# EAGLE design MUX-V2 (EAGLE 7.6.0)
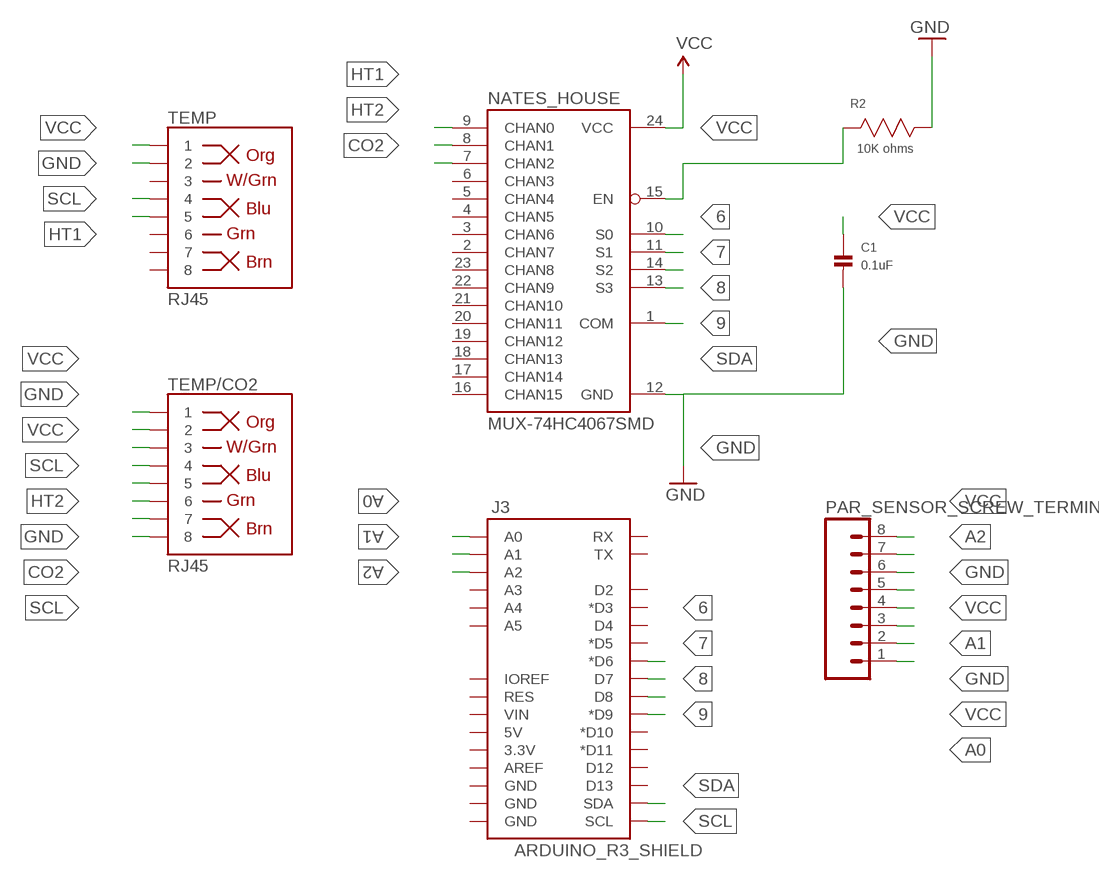
[diagram p0: schematic, sheet 1]

## Parts
C1  0.1uF  CAP_CERAMIC_0805  [_0805]
J3  ARDUINO_R3_SHIELD  [UNO_R3_SHIELD]
NATES_HOUSE  MUX-74HC4067SMD  [SSOP24]
PAR_SENSOR_SCREW_TERMINALS  M083.5MM-8  [SCREWTERMINAL-3.5MM-8]
R2  10K ohms  MCR10EZHF1002  [RESC2013X65N]
TEMP  RJ45  RJ45-8PTH  [RJ45-8]
TEMP/CO2  RJ45  RJ45-8PTH  [RJ45-8]

## Nets
6: J3.D6(*D6) NATES_HOUSE.10(S0)
7: J3.D7 NATES_HOUSE.11(S1)
8: J3.D8 NATES_HOUSE.14(S2)
9: J3.D9(*D9) NATES_HOUSE.13(S3)
12: R2.1(R1) ; supply symbol labelled GND
A0: J3.A0 PAR_SENSOR_SCREW_TERMINALS.1
A1: J3.A1 PAR_SENSOR_SCREW_TERMINALS.4
A2: J3.A2 PAR_SENSOR_SCREW_TERMINALS.7
CO2: NATES_HOUSE.7(CHAN2) TEMP/CO2.7
GND: C1.2 NATES_HOUSE.12(GND) PAR_SENSOR_SCREW_TERMINALS.3 PAR_SENSOR_SCREW_TERMINALS.6 TEMP.2 TEMP/CO2.2 TEMP/CO2.6
HT1: NATES_HOUSE.9(CHAN0) TEMP.5
HT2: NATES_HOUSE.8(CHAN1) TEMP/CO2.5
N$1: NATES_HOUSE.15(EN) R2.2(R2)
SCL: J3.SCL TEMP.4 TEMP/CO2.4 TEMP/CO2.8
SDA: J3.SDA NATES_HOUSE.1(COM)
VCC: C1.1 NATES_HOUSE.24(VCC) PAR_SENSOR_SCREW_TERMINALS.2 PAR_SENSOR_SCREW_TERMINALS.5 PAR_SENSOR_SCREW_TERMINALS.8 TEMP.1 TEMP/CO2.1 TEMP/CO2.3
Unconnected: J3.3.3V J3.5V J3.A3 J3.A4 J3.A5 J3.AREF J3.D2 J3.D3(*D3) J3.D4 J3.D5(*D5) J3.D10(*D10) J3.D11(*D11) J3.D12 J3.D13 J3.GND@0(GND) J3.GND@1(GND) J3.GND@2(GND) J3.IOREF J3.RES J3.RX J3.TX J3.VIN NATES_HOUSE.2(CHAN7) NATES_HOUSE.3(CHAN6) NATES_HOUSE.4(CHAN5) NATES_HOUSE.5(CHAN4) NATES_HOUSE.6(CHAN3) NATES_HOUSE.16(CHAN15) NATES_HOUSE.17(CHAN14) NATES_HOUSE.18(CHAN13) NATES_HOUSE.19(CHAN12) NATES_HOUSE.20(CHAN11) NATES_HOUSE.21(CHAN10) NATES_HOUSE.22(CHAN9) NATES_HOUSE.23(CHAN8) TEMP.3 TEMP.6 TEMP.7 TEMP.8

## Library data of the parts
C1 = microbuilder:CAP_CERAMIC: Ceramic Capacitors 0402 - 0402 Surface Mount Capacitors 16pF 50V 5% [Digikey: 445-4899-2-ND] 18pF 50V 5% [Digikey: 490-1281-2-ND] 22pF 50V 5% [Digikey: 490-1283-2-ND] 68pF 50V 5% [Digikey: 490-1289-2-ND] 0.1uF 10V 10% [Digikey: 490-1318-2-ND] 1.0uF 6.3V 10% [Digikey: 490-1320-2-ND] 0603 - 0603 Surface Mount Capacitors 16 pF 50V 5% [Digikey: 445-5051-2-ND] 22 pF 50V [Digikey: PCC220ACVTR-ND] 33 pF 50V 5% [Digikey: 490-1415-1-ND] 56pF 50V 5% [Digikey: 490-1421-1-ND] 220pF 50V 5% [Digikey: 445-1285-1-ND] 680 pF 50V 2200 pF 50V 5% C0G [Digikey: 445-1297-1-ND] 5600 pF 100V 5% X7R [Digikey: 478-3711-1-ND] 0.1 µF 25V 10% [Digikey: PCC2277TR-ND] 0.22 µF 16V 10% X7R [Digikey: 445-1318-1-ND] 1.0 µF 25V 10% [Digikey: 445-5146-2-ND] 0603 - RF Specific 3pF 250V +/-0.1pF RF [Digikey: 712-1347-1-ND] 18 pF 250V 5% [Digikey: 478-3505-1-ND or 712-1322-1-ND] 56 pF 250V 5% C0G RF [Digikey: 490-4867-1-ND] 68 pF 250V RF [Digikey: 490-4868-1-ND] 0805 - 0805 Surface Mount Capacitors 220 pF 250V 2% RF Ceramic Capacitor [Digikey: 712-1398-1-ND] 1000 pF 50V 2% NP0 Ceramic Capacitor [Digikey: 478-3760-1-ND] 0.1 µF 25V 10% Ceramic Capacitor [Digikey: PCC1828TR-ND] 1.0 µF 16V 10% Ceramic Capacitor[Digikey: 490-1691-2-ND] 10.0 µF 10V 10% Ceramic Capacitor[Digikey: 709-1228-1-ND] 10.0 uF 16V 10% Ceramic Capacitor [Digikey: 478-5165-2-ND] 47 uF 6.3V 20% Ceramic Capacitor [Digikey: 587-1779-1-ND or 399-5506-1-ND] 1206 - 1206 Surface Mount Capacitors 47uF 10V 20% Ceramic Capacitor [Digikey: 490-5528-1-ND or 399-5508-1-ND or 445-6010-1-ND] 100uF 6.3V -20%, +80% Y5V Ceramic Capacitor (Digikey: 490-4512-1-ND, Mouser: 81-GRM31CF50J107ZE1L)
J3 = SparkFun-Boards:ARDUINO_R3_SHIELD: Shield form compatible with the Arduino Uno R3.
NATES_HOUSE = SparkFun-AnalogIC:MUX-74HC4067: 16-channel analog MUX; PROD_ID: IC-08252
PAR_SENSOR_SCREW_TERMINALS = SparkFun-Connectors:M08: Header 8 Standard 8-pin 0.1" header. Use with straight break away headers (SKU : PRT-00116), right angle break away headers (PRT-00553), swiss pins (PRT-00743), machine pins (PRT-00117), and female headers (PRT-00115).
R2 = ROHM_By_element14_Batch_1:MCR10EZHF1002: RESISTOR, 0805; MPN: MCR10EZHF1002; OC_FARNELL: -; OC_NEWARK: 08P3530; SUPPLIER: ROHM; TOLERANCE: ±1%; VALUE: 10K Ohms; WATTAGE: 1/8 W
TEMP TEMP/CO2 = SparkFun-Connectors:RJ45-8: RJ45 Jack Simple RJ45, 8-pin connection - connector for common Cat5, Cat5e, and Cat6 Ethernet cables. Footprint not yet proven in production. Connector sku is PRT-00643; Breakout PCB sku is BOB-00716.; PROD_ID: CONN-08506

## Net classes
0 default: width 0.305 mm, drill 0.508 mm, clearance 0.254 mm

## Board
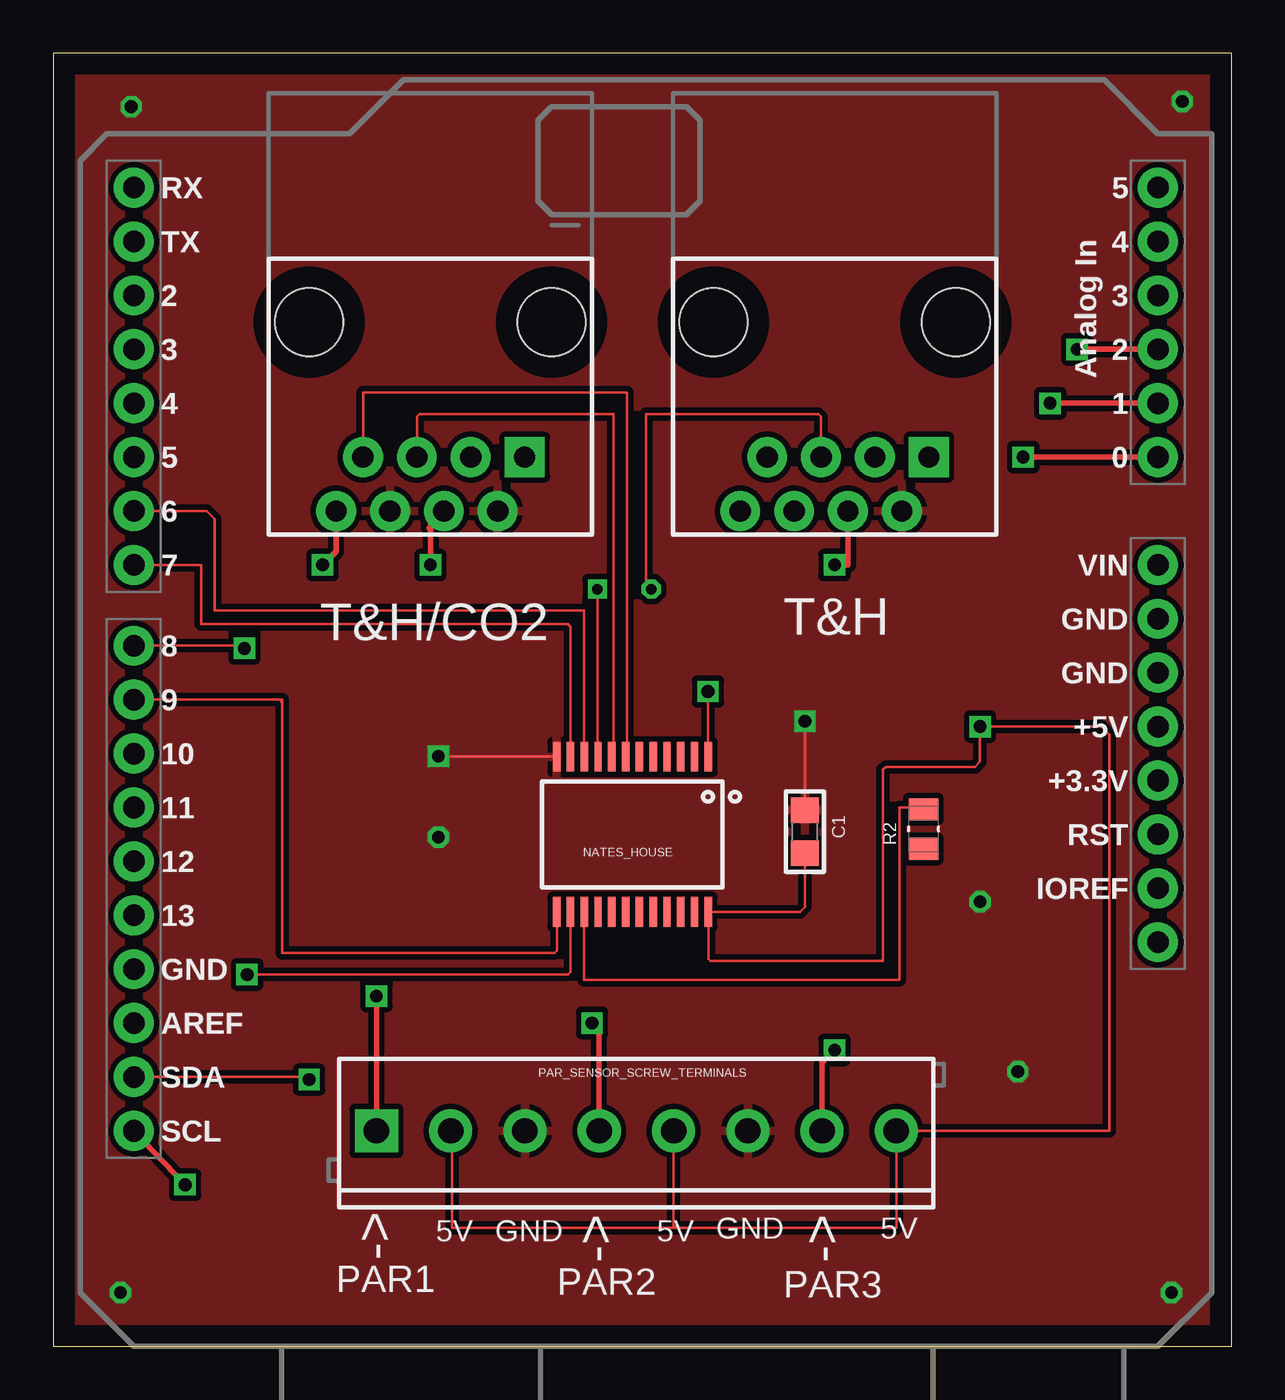
[diagram p1: board, top side]
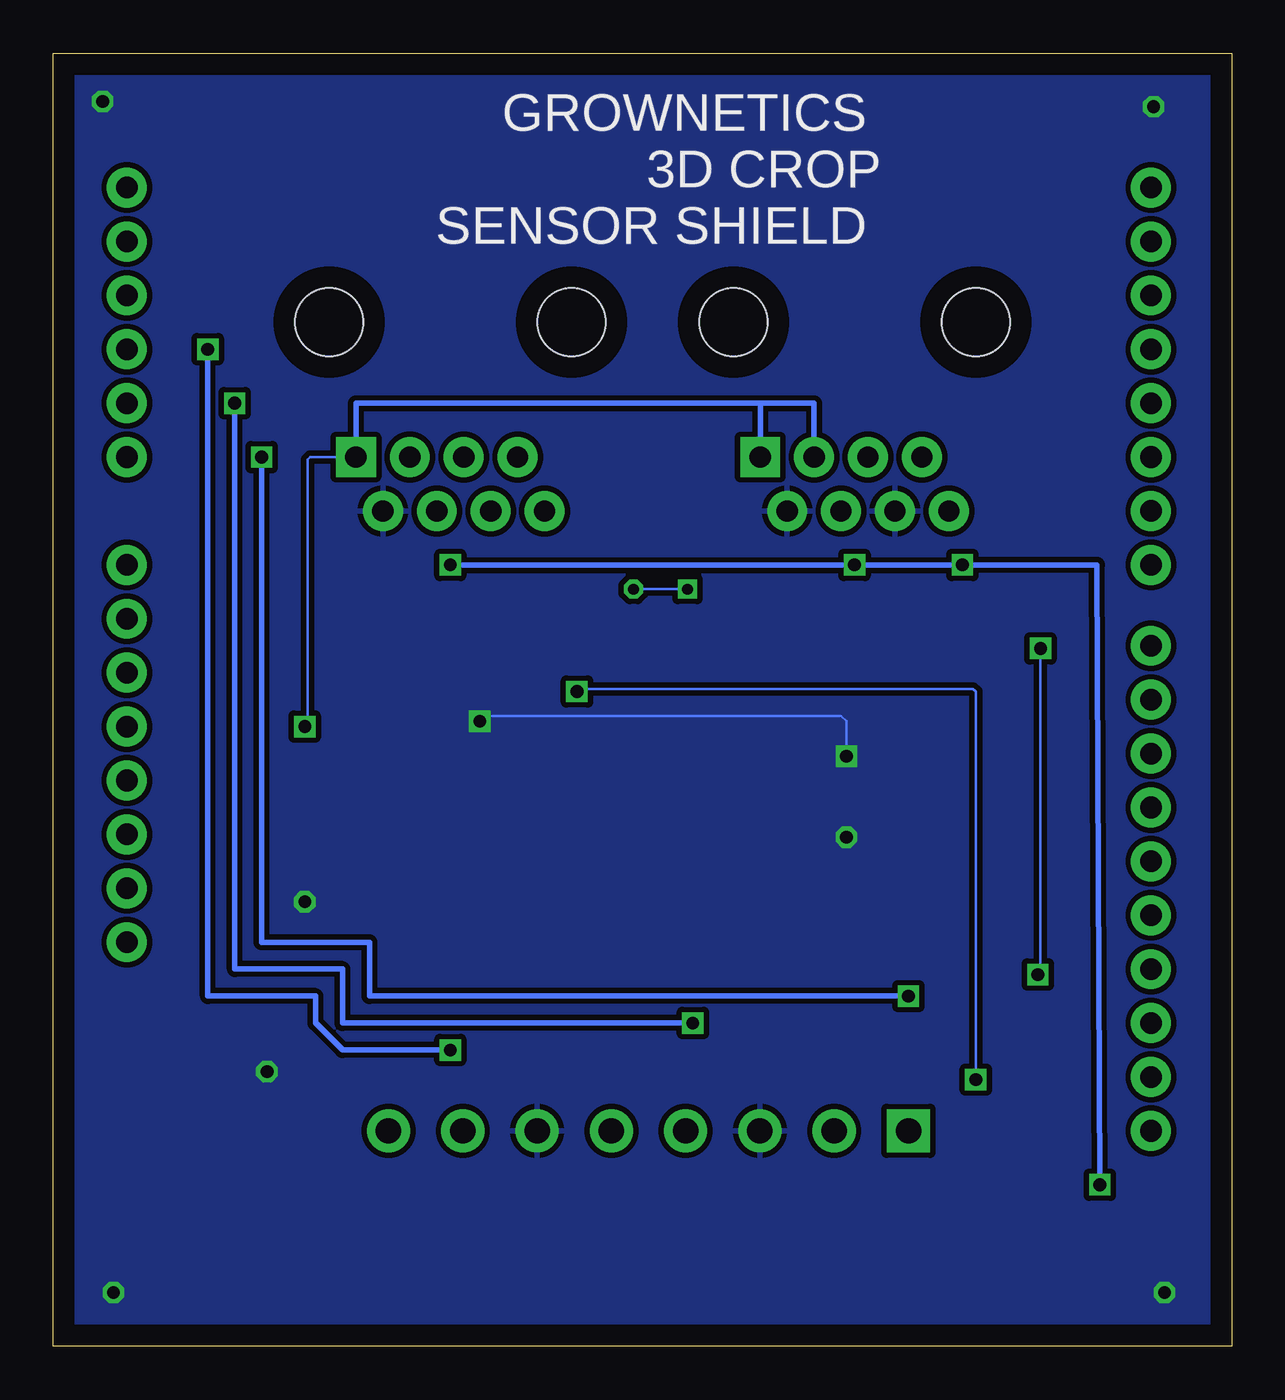
[diagram p2: board, bottom side, seen from below]

Size 55.55 x 60.95 mm. Coordinates in mm from the lower left corner, seen from the top.
Outline: 0,0 55.55,0 55.55,60.95 0,60.95 0,0
Copper layers (1*16): Top 0.035mm / dielectric 1.5mm / Bottom 0.035mm
Design rules "default": minimum track width 10mil, minimum drill 24mil, track to track 8mil, track to pad 8mil, pad to pad 8mil, via to via 8mil, smd to smd 8mil, copper to edge 40mil, drill to drill 8mil, minimum pad ring 10mil, minimum via ring 8mil, stop-mask expansion 4mil, vias tented up to drill 0mil, thermal gap 10mil

### Footprints (pad centres in the part's own frame; a part is rotated, then mirrored left to right if it is on the bottom)
_0805 = smd 1.2 x 1.3: 1 -1.016,0; 2 1.016,0
UNO_R3_SHIELD = drill 1.016 pad 1.88: 3.3V 50.8,26.67; 5V 50.8,29.21; A0 50.8,41.91; A1 50.8,44.45; A2 50.8,46.99; A3 50.8,49.53; A4 50.8,52.07; A5 50.8,54.61; AREF 2.54,15.24; D2 2.54,49.53; D3 2.54,46.99; D4 2.54,44.45; D5 2.54,41.91; D6 2.54,39.37; D7 2.54,36.83; D8 2.54,33.02; D9 2.54,30.48; D10 2.54,27.94; D11 2.54,25.4; D12 2.54,22.86; D13 2.54,20.32; GND@0 50.8,31.75; GND@1 50.8,34.29; GND@2 2.54,17.78; IOREF 50.8,21.59; NC 50.8,19.05; RES 50.8,24.13; RX 2.54,54.61; SCL 2.54,10.16; SDA 2.54,12.7; TX 2.54,52.07; VIN 50.8,36.83
SSOP24 = smd 0.348 x 1.397: 1 -3.575,-3.656; 2 -2.925,-3.656; 3 -2.275,-3.656; 4 -1.625,-3.656; 5 -0.975,-3.656; 6 -0.325,-3.656; 7 0.325,-3.656; 8 0.975,-3.656; 9 1.625,-3.656; 10 2.275,-3.656; 11 2.925,-3.656; 12 3.575,-3.656; 13 3.575,3.656; 14 2.925,3.656; 15 2.275,3.656; 16 1.625,3.656; 17 0.975,3.656; 18 0.325,3.656; 19 -0.325,3.656; 20 -0.975,3.656; 21 -1.625,3.656; 22 -2.275,3.656; 23 -2.925,3.656; 24 -3.575,3.656
SCREWTERMINAL-3.5MM-8 = drill 1.2 pad 2.032 square: 1 0,0 | drill 1.2 pad 2.032: 2 3.5,0; 3 7,0; 4 10.5,0; 5 14,0; 6 17.5,0; 7 21,0; 8 24.5,0
RESC2013X65N = smd 1.016 x 1.397: 1 -0.94,0; 2 0.94,0
RJ45-8 = drill 1 pad 1.88 square: 1 -4.445,6.35 | drill 1 pad 1.88: 2 -3.175,8.89; 3 -1.905,6.35; 4 -0.635,8.89; 5 0.635,6.35; 6 1.905,8.89; 7 3.175,6.35; 8 4.445,8.89 | hole 3.2: -5.715,0; 5.715,0

### Placement (x,y rotation side)
C1  35.43,24.26 90 top
J3  1.27,0 0 top
NATES_HOUSE  27.3,24.13 180 top
PAR_SENSOR_SCREW_TERMINALS  15.24,10.16 0 top
R2  41.02,24.38 90 top
TEMP  36.83,48.26 180 top
TEMP/CO2  17.78,48.26 180 top

### Tracks (layer width: path | path; a pad name or v marks a point on that pad's centre or on a via)
6
  Top 0.127: NATES_HOUSE.10 25.03,34.66 25.02,34.67 7.62,34.67 7.62,38.99 7.24,39.37 J3.D6
7
  Top 0.127: NATES_HOUSE.11 24.38,29.08 | 24.38,29.08 | 24.38,29.08 24.38,33.91 24.26,34.04 6.98,34.04 6.98,36.83 J3.D7
8  (via drill 0.6)
  Top 0.127: J3.D8 8.89,33.02 v9.02,32.89 | v9.14,17.53 24.26,17.53 24.38,17.65 24.38,20.07 NATES_HOUSE.14
  Bottom 0.127: v9.02,32.89 9.02,17.65 v9.14,17.53
9
  Top 0.127: 10.79,30.48 10.79,30.35 | 10.79,30.35 10.79,18.54 23.62,18.54 23.75,18.67 23.75,20.45 NATES_HOUSE.13 | J3.D9 10.67,30.48 10.79,30.35
A0  (via drill 0.6)
  Top 0.254: PAR_SENSOR_SCREW_TERMINALS.1 v15.24,16.51 | v45.72,41.91 J3.A0
  Bottom 0.254: v15.24,16.51 40.64,16.51 40.64,19.05 45.72,19.05 v45.72,41.91
A1  (via drill 0.6)
  Top 0.254: PAR_SENSOR_SCREW_TERMINALS.4 25.74,14.9 v25.4,15.24 | v46.99,44.45 J3.A1
  Bottom 0.254: v25.4,15.24 41.91,15.24 41.91,17.78 46.99,17.78 v46.99,44.45
A2  (via drill 0.6)
  Top 0.254: PAR_SENSOR_SCREW_TERMINALS.7 36.24,13.38 v36.83,13.97 | v48.26,46.99 J3.A2
  Bottom 0.254: v36.83,13.97 41.91,13.97 43.18,15.24 43.18,16.51 48.26,16.51 v48.26,46.99
CO2
  Top 0.127: TEMP/CO2.7 14.61,44.96 27.05,44.96 27.05,27.86 NATES_HOUSE.7
GND  (via drill 0.6)
  Top 0.127: C1.2 v35.43,29.46 | v18.16,27.81 23.7,27.81 NATES_HOUSE.12
  Bottom 0.127: v35.43,29.46 35.43,29.59 35.31,29.72 18.41,29.72 18.16,29.46 v18.16,27.81
  other vias: 52.71,2.54 45.47,12.95 18.16,24 3.17,2.54 3.68,58.42 53.21,58.67 43.69,20.95
  pour Top: 0,60.96 55.88,60.96 55.88,0 0,0
  pour Bottom: -1.27,62.23 57.15,62.23 57.15,60.96 57.15,-1.27 -1.27,-1.27
HT1  (via drill 0.5)
  Top 0.127: TEMP.5 36.2,43.81 36.07,43.94 27.94,43.94 27.94,35.94 v28.19,35.69 | v25.65,35.69 25.65,27.81 NATES_HOUSE.9
  Bottom 0.127: v28.19,35.69 v25.65,35.69
HT2
  Top 0.127: TEMP/CO2.5 17.14,43.81 17.27,43.94 26.42,43.94 26.42,27.83 NATES_HOUSE.8
N$1
  Top 0.127: NATES_HOUSE.15 25.03,19.95 25.02,17.27 39.88,17.27 39.88,25.4 40.95,25.4 R2.2
SCL  (via drill 0.6)
  Top 0.254: J3.SCL v6.22,7.62 | v12.7,36.83 13.33,37.47 TEMP/CO2.8 | 17.78,38.73 17.78,38.56 v17.78,36.83 | TEMP.4 37.47,36.83 v36.83,36.83
  Top 0.305: TEMP/CO2.4 18.31,39.12 17.75,38.56 17.78,38.56
  Bottom 0.254: v6.22,7.62 6.35,36.83 v12.7,36.83 v17.78,36.83 v36.83,36.83
SDA  (via drill 0.6)
  Top 0.127: J3.SDA 11.94,12.7 v12.06,12.57 | v30.86,30.86 30.86,27.8 NATES_HOUSE.1
  Bottom 0.127: v12.06,12.57 12.06,30.86 12.19,30.99 30.73,30.99 v30.86,30.86
VCC  (via drill 0.6)
  Top 0.127: 29.46,5.59 39.75,5.59 39.74,5.6 PAR_SENSOR_SCREW_TERMINALS.8 49.78,10.16 49.78,28.83 49.4,29.21 v43.69,29.21 43.69,27.56 43.43,27.3 39.24,27.3 39.12,27.18 39.12,18.16 30.99,18.16 30.88,18.27 NATES_HOUSE.24 35.21,20.47 35.43,20.7 C1.1 | 29.46,5.59 18.8,5.59 18.8,10.1 PAR_SENSOR_SCREW_TERMINALS.2 | PAR_SENSOR_SCREW_TERMINALS.5 29.24,5.68 29.46,5.59
  Bottom 0.127: TEMP.1 43.43,41.91 43.56,41.78 43.56,29.34 v43.69,29.21
  Bottom 0.254: TEMP.1 41.28,44.45 22.22,44.45 | 22.22,44.45 19.68,44.45 TEMP/CO2.3 | TEMP/CO2.1 22.22,44.45

### Text on the board
tPlace: T&H/CO2 | T&H | 5V | GND | 5V | GND | 5V | -> | -> | -> | PAR1 | PAR2 | PAR3
bPlace: GROWNETICS / 3D CROP / SENSOR SHIELD